# Altium project PantherZVS.PrjPCB
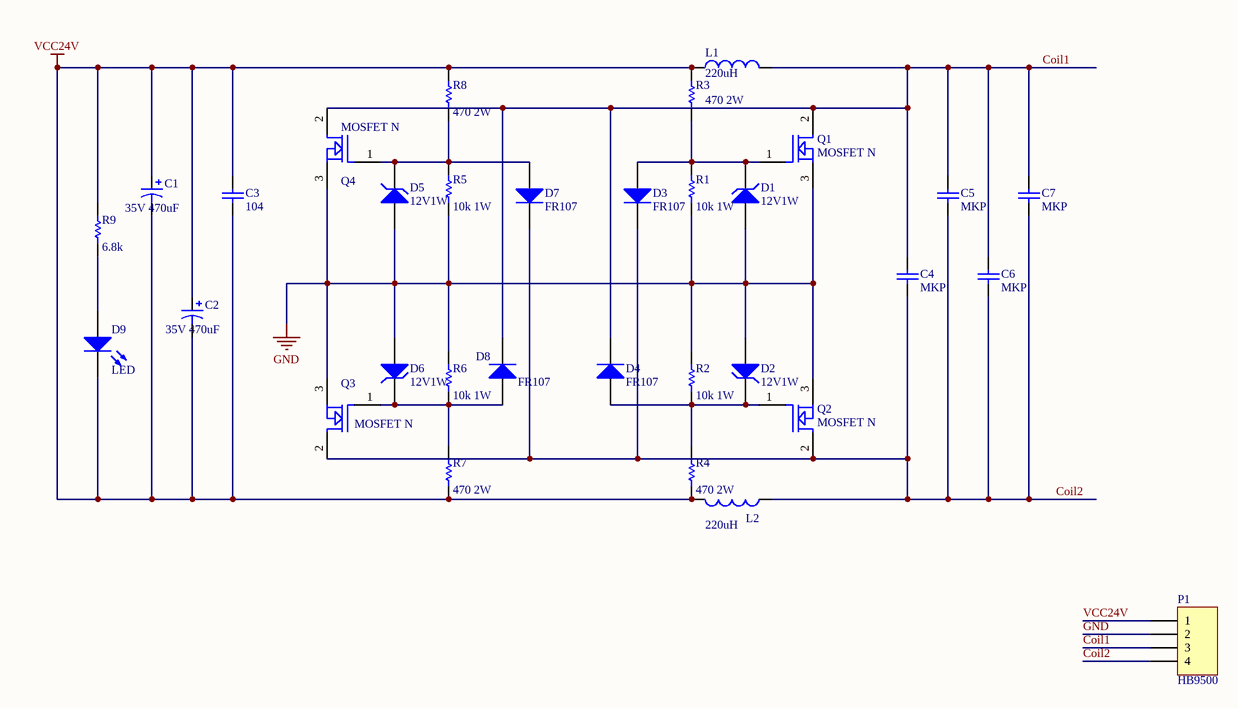
[diagram p0: PantherZVS.SchDoc]
1 sheet, 32 parts. Net scope: global (net labels, ports and power ports of the same name join across sheets).

## Sheet PantherZVS.SchDoc: PantherZVS
size A4; Author: Lordz Zidel; DrawnBy: Lordz Zidel; Engineer: Lordz Zidel; Organization: T.WKVER; DocumentNumber: 1; Revision: v0p1_LTE; SheetNumber: 1; ProjectName: PantherZVS

### Parts
C1  value 35V 470uF  [C4_5_10mm]
C2  value 35V 470uF  [C4_5_10mm]
C3  104  [RAD-0.3]
C4  MKP  [MKP_Capacitor]
C5  MKP  [MKP_Capacitor]
C6  MKP  [MKP_Capacitor]
C7  MKP  [MKP_Capacitor]
D1  12V1W  [DIODE-0.4]
D2  12V1W  [DIODE-0.4]
D3  FR107  [DIODE-0.4]
D4  FR107  [DIODE-0.4]
D5  12V1W  [DIODE-0.4]
D6  12V1W  [DIODE-0.4]
D7  FR107  [DIODE-0.4]
D8  FR107  [DIODE-0.4]
D9  LED  [0805]
L1  value 220uH  [HBL_30_10_H]
L2  value 220uH  [HBL_30_10_H]
P1  HB9500  [HB9500_4P]
Q1  MOSFET N  [TO-247AC_ZCEDGE]
Q2  MOSFET N  [TO-247AC_ZCEDGE]
Q3  MOSFET N  [TO-247AC_ZCEDGE]
Q4  MOSFET N  [TO-247AC_ZCEDGE]
R1  value 10k 1W  [1WZC]
R2  value 10k 1W  [1WZC]
R3  value 470 2W  [1WZC]
R4  value 470 2W  [2WZC]
R5  value 10k 1W  [1WZC]
R6  value 10k 1W  [1WZC]
R7  value 470 2W  [2WZC]
R8  value 470 2W  [2WZC]
R9  value 6.8k  [AXIAL-0.3]

### Nets
GND: D1.1(A) D2.1(A) D5.1(A) D6.1(A) P1.2 Q1.3(S) Q2.3(S) Q3.3(S) Q4.3(S) R1.1 R2.2 R5.2 R6.1
VCC24V: C1.1 C1.2 C2.1 C2.2 C3.1 C3.2 D9.2(K) L1.1 L2.2 P1.1 R3.2 R4.1 R7.2 R8.1 R9.2
Coil1: C4.2 C5.2 C6.2 C7.2 D4.2(K) D8.2(K) L1.2 P1.3 Q1.2(D) Q4.2(D)
Coil2: C4.1 C5.1 C6.1 C7.1 D3.2(K) D7.2(K) L2.1 P1.4 Q2.2(D) Q3.2(D)
NetD1_2: D1.2(K) D3.1(A) Q1.1(G) R1.2 R3.1
NetD2_2: D2.2(K) D4.1(A) Q2.1(G) R2.1 R4.2
NetD5_2: D5.2(K) D7.1(A) Q4.1(G) R5.1 R8.2
NetD6_2: D6.2(K) D8.1(A) Q3.1(G) R6.2 R7.1
NetD9_1: D9.1(A) R9.1

### Library data of the parts
C1 C2 = Cap Pol1: Polarized Capacitor (Radial); pin to pad: 1>2 2>1; Published: 8-Jun-2000; LatestRevisionDate: 17-Jul-2002; LatestRevisionNote: Re-released for DXP Platform.; PackageReference: RB7.6-15; Publisher: Altium Limited; PackageDescription: Polarized Capacitor (Radial); 2 Leads
C3-C7 = Cap: Capacitor; Published: 8-Jun-2000; LatestRevisionDate: 17-Jul-2002; LatestRevisionNote: Re-released for DXP Platform.; PackageReference: RAD-0.3; Publisher: Altium Limited; PackageDescription: Radial Cap, Thru-Hole; 2 Leads; 0.3 in Pin Spacing
D1 D2 D5 D6 = D Zener: Zener Diode; Published: 8-Jun-2000; LatestRevisionDate: 17-Jul-2002; LatestRevisionNote: Re-released for DXP Platform.; PackageReference: DIODE-0.7; Publisher: Altium Limited; PackageDescription: Diode, Thru-Hole; 2 Leads; 0.7 in Pin Spacing
D3 D4 D7 D8 = Diode 1N4001: 1 Amp General Purpose Rectifier; Published: 8-Jun-2000; LatestRevisionDate: 17-Jul-2002; LatestRevisionNote: Re-released for DXP Platform.; DatasheetVersion: 1998; PackageVersion: Aug-1999; PackageReference: DO-41; Publisher: Altium Limited; PackageDescription: Diode, Axial; Body 5.2 x 2.7 mm (LxDia. max), Lead Dia. 0.86 mm (max); Code_JEDEC: DO-204-AL; ComponentLink1Description: Manufacturer Link; ComponentLink1URL: http://www.fairchildsemi.com/; ComponentLink2Description: Datasheet; ComponentLink2URL: http://www.fairchildsemi.com/ds/1N%2F1N4001.pdf
D9 = LED0: Typical INFRARED GaAs LED; Published: 8-Jun-2000; LatestRevisionDate: 08-Jul-2005; LatestRevisionNote: Mech Layer 1 removed.; PackageReference: LED-0; Publisher: Altium Limited; PackageDescription: LED; 2 Leads
L1 L2 = Inductor: Code_IEC: 1005; Published: 8-Jun-2000; LatestRevisionDate: 29-May-2009; LatestRevisionNote: IPC-7351 Footprint Added.; PackageReference: 0402-A; Publisher: Altium Limited; PackageDescription: Chip Inductor; Code_JEITA: 0402
P1 = Header 4: Header, 4-Pin; LatestRevisionDate: 17-Jul-2002; LatestRevisionNote: Re-released for DXP Platform.; Publisher: Altium Limited
Q1-Q4 = MOSFET N: Max Voltage: 200V; Max Current: 50A
R1-R9 = Res1: Resistor; Published: 8-Jun-2000; LatestRevisionDate: 17-Jul-2002; LatestRevisionNote: Re-released for DXP Platform.; PackageReference: AXIAL-0.3; Publisher: Altium Limited; PackageDescription: Axial Device, Thru-Hole; 2 Leads; 0.3 in Pin Spacing